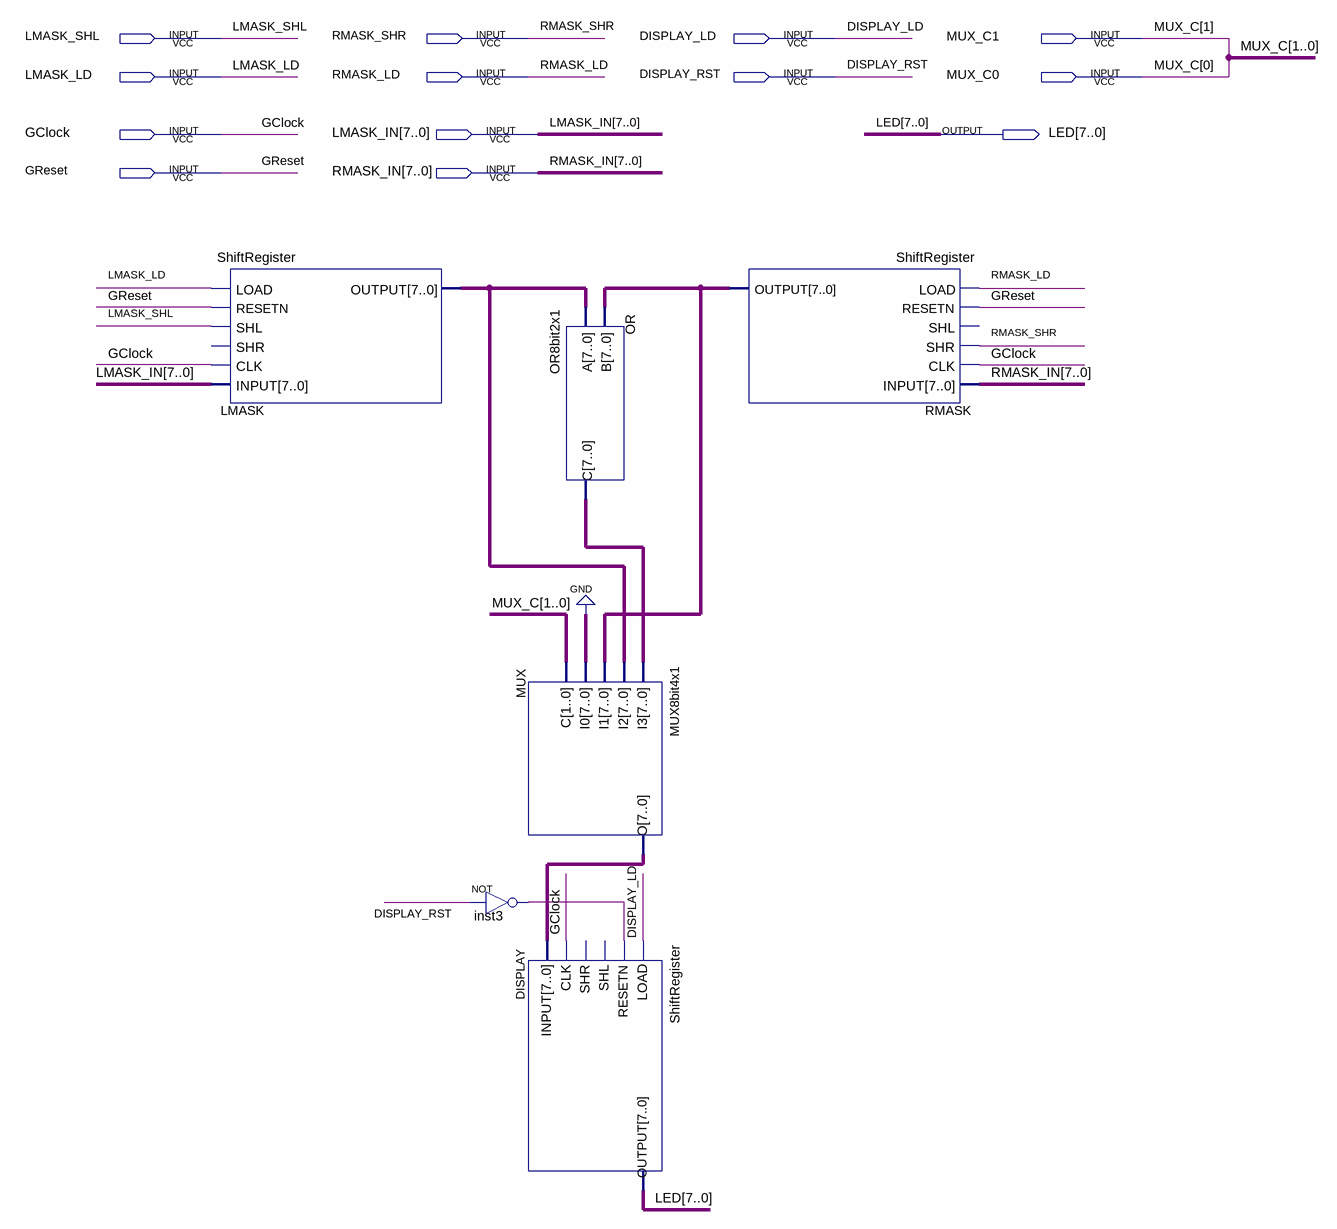
[diagram p0: schematic sheet]
// Quartus schematic Datapath.bdf as structural Verilog: 6 symbols, 13 pins
module Datapath (
  input  LMASK_SHL,
  input  RMASK_SHR,
  input  DISPLAY_LD,
  input  MUX_C1,
  input  LMASK_LD,
  input  RMASK_LD,
  input  DISPLAY_RST,
  input  MUX_C0,
  input  GClock,
  input  [7:0] LMASK_IN,
  input  GReset,
  input  [7:0] RMASK_IN,
  output [7:0] LED
);

  wire inst3_out;
  wire [7:0] LMASK_output, MUX_o, OR_c, RMASK_output;

  ShiftRegister LMASK (
    .LOAD(LMASK_LD), .RESETN(GReset), .SHL(LMASK_SHL), .CLK(GClock), .INPUT(LMASK_IN), .OUTPUT(LMASK_output));  // open: SHR
  MUX8bit4x1 MUX (.I3(OR_c), .I2(LMASK_output), .I1(RMASK_output), .I0({8{1'b0}}), .C({MUX_C1, MUX_C0}), .O(MUX_o));
  not inst3 (inst3_out, DISPLAY_RST);
  ShiftRegister DISPLAY (
    .LOAD(DISPLAY_LD), .RESETN(inst3_out), .CLK(GClock), .INPUT(MUX_o), .OUTPUT(LED));  // open: SHL, SHR
  OR8bit2x1 OR (.A(LMASK_output), .B(RMASK_output), .C(OR_c));
  ShiftRegister RMASK (
    .LOAD(RMASK_LD), .RESETN(GReset), .SHR(RMASK_SHR), .CLK(GClock), .INPUT(RMASK_IN), .OUTPUT(RMASK_output));  // open: SHL
endmodule
